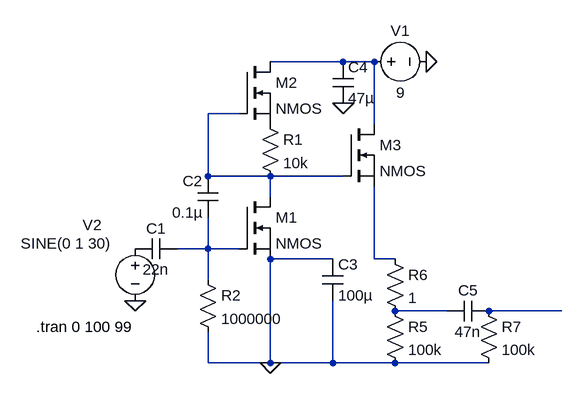
[diagram p0: schematic fetfuzz.asc]
fetfuzz.asc, the LTspice schematic file:
Version 4
SHEET 1 880 680
WIRE 400 -112 288 -112
WIRE 448 -112 400 -112
WIRE 240 -32 192 -32
WIRE 448 -16 448 -112
WIRE 192 64 192 -32
WIRE 288 64 192 64
WIRE 400 64 288 64
WIRE 288 96 288 64
WIRE 192 176 192 128
WIRE 192 176 144 176
WIRE 240 176 192 176
WIRE 384 192 288 192
WIRE 448 192 448 80
WIRE 480 192 448 192
WIRE 192 224 192 176
WIRE 560 272 480 272
WIRE 736 272 624 272
WIRE 192 352 192 304
WIRE 288 352 288 192
WIRE 288 352 192 352
WIRE 384 352 384 256
WIRE 384 352 288 352
WIRE 480 352 384 352
WIRE 624 352 480 352
FLAG 400 -48 0
FLAG 288 352 0
FLAG 528 -112 0
FLAG 80 256 0
SYMBOL cap 144 160 R90
WINDOW 0 0 32 VBottom 2
WINDOW 3 32 32 VTop 2
SYMATTR InstName C1
SYMATTR Value 22n
SYMBOL cap 208 128 R180
WINDOW 0 24 56 Left 2
WINDOW 3 24 8 Left 2
SYMATTR InstName C2
SYMATTR Value 0.1µ
SYMBOL nmos 240 96 R0
SYMATTR InstName M1
SYMBOL nmos 240 -112 R0
SYMATTR InstName M2
SYMBOL nmos 400 -16 R0
SYMATTR InstName M3
SYMBOL res 272 -32 R0
SYMATTR InstName R1
SYMATTR Value 10k
SYMBOL res 176 208 R0
SYMATTR InstName R2
SYMATTR Value 1000000
SYMBOL cap 368 192 R0
SYMATTR InstName C3
SYMATTR Value 100µ
SYMBOL res 464 256 R0
SYMATTR InstName R5
SYMATTR Value 100k
SYMBOL res 464 176 R0
SYMATTR InstName R6
SYMATTR Value 1
SYMBOL cap 384 -112 R0
SYMATTR InstName C4
SYMATTR Value 47µ
SYMBOL voltage 432 -112 R270
WINDOW 0 32 56 VTop 2
WINDOW 3 -32 56 VBottom 2
WINDOW 123 0 0 Left 0
WINDOW 39 0 0 Left 0
SYMATTR InstName V1
SYMATTR Value 9
SYMBOL cap 624 256 R90
WINDOW 0 0 32 VBottom 2
WINDOW 3 32 32 VTop 2
SYMATTR InstName C5
SYMATTR Value 47n
SYMBOL res 608 256 R0
SYMATTR InstName R7
SYMATTR Value 100k
SYMBOL voltage 80 160 R0
WINDOW 0 -81 -21 Left 2
WINDOW 3 -176 8 Left 2
WINDOW 123 0 0 Left 0
WINDOW 39 0 0 Left 0
SYMATTR InstName V2
SYMATTR Value SINE(0 1 30)
TEXT -72 296 Left 2 !.tran 0 100 99

The netlist it stands for:
* fetfuzz.asc
C1 N003 P001 22n
C2 N003 N002 0.1µ
M1 N002 N003 0 0 NMOS
M2 N001 N002 P002 P002 NMOS
M3 N001 N002 N004 N004 NMOS
R1 P002 N002 10k
R2 N003 0 1000000
C3 0 0 100µ
R5 N005 0 100k
R6 N004 N005 1
C4 N001 0 47µ
V1 N001 0 9
C5 N006 N005 47n
R7 N006 0 100k
V2 P001 0 SINE(0 1 30)
.model NMOS NMOS
.model PMOS PMOS
.lib standard.mos
.tran 0 100 99
.backanno
.end